# EAGLE schematic untitled (EAGLE 9.6.2)
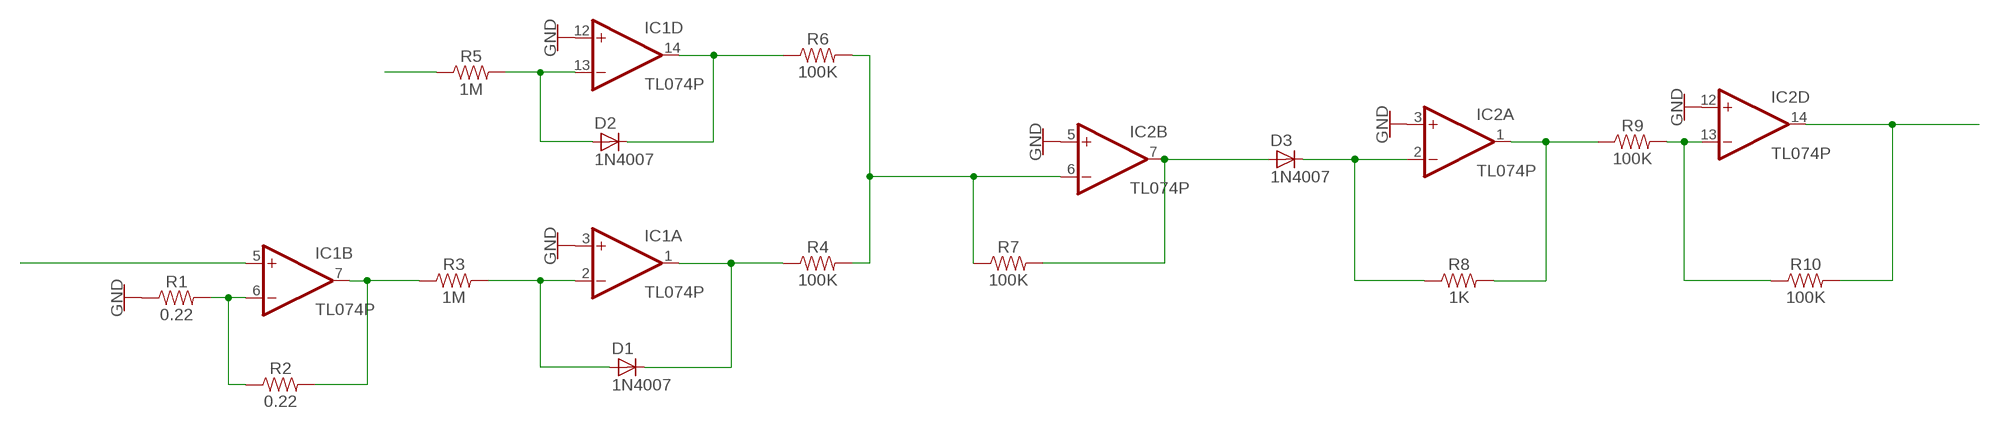
[diagram p0: schematic, sheet 1]

## Parts
D1  1N4007  [SMA]
D2  1N4007  [SMA]
D3  1N4007  [SMA]
IC1  TL074P  [DIL14]
IC2  TL074P  [DIL14]
R1  0.22  0.22OHM-0805-1/4W-1%  [0805]
R2  0.22  0.22OHM-0805-1/4W-1%  [0805]
R3  1M  0.22OHM-0805-1/4W-1%  [0805]
R4  100K  0.22OHM-0805-1/4W-1%  [0805]
R5  1M  0.22OHM-0805-1/4W-1%  [0805]
R6  100K  0.22OHM-0805-1/4W-1%  [0805]
R7  100K  0.22OHM-0805-1/4W-1%  [0805]
R8  1K  0.22OHM-0805-1/4W-1%  [0805]
R9  100K  0.22OHM-0805-1/4W-1%  [0805]
R10  100K  0.22OHM-0805-1/4W-1%  [0805]

## Nets
GND: IC1.3(A:+IN) IC1.12(D:+IN) IC2.3(A:+IN) IC2.5(B:+IN) IC2.12(D:+IN) R1.1
N$1: IC1.5(B:+IN)
N$2: IC1.6(B:-IN) R1.2 R2.1
N$3: IC1.7(B:OUT) R2.2 R3.1
N$4: D1.A IC1.2(A:-IN) R3.2
N$5: D1.K(C) IC1.1(A:OUT) R4.1
N$6: D2.K(C) IC1.14(D:OUT) R6.1
N$7: R5.1
N$8: D2.A IC1.13(D:-IN) R5.2
N$9: D3.A IC2.7(B:OUT) R7.2
N$10: D3.K(C) IC2.2(A:-IN) R8.1
N$11: IC2.6(B:-IN) R4.2 R6.2 R7.1
N$12: IC2.1(A:OUT) R8.2 R9.1
N$13: IC2.13(D:-IN) R9.2 R10.1
N$14: IC2.14(D:OUT) R10.2
Unconnected: IC1.8(C:OUT) IC1.9(C:-IN) IC1.10(C:+IN) IC2.8(C:OUT) IC2.9(C:-IN) IC2.10(C:+IN)

## Power pins joined to a net without a drawn wire
V+: IC1.4(P:V+) IC2.4(P:V+)
V-: IC1.11(P:V-) IC2.11(P:V-)

## Library data of the parts
D1-D3 = casovac:1N4007
IC1 IC2 = linear3:TL074: OP AMP
R1 R2 = SparkFun-Resistors:0.22OHM: 0.22Ω resistor A resistor is a passive two-terminal electrical component that implements electrical resistance as a circuit element. Resistors act to reduce current flow, and, at the same time, act to lower voltage levels within circuits. - Wikipedia; PROD_ID: RES-09883
R3-R10 = SparkFun-Resistors:0.22OHM: 0.22Ω resistor A resistor is a passive two-terminal electrical component that implements electrical resistance as a circuit element. Resistors act to reduce current flow, and, at the same time, act to lower voltage levels within circuits. - Wikipedia; PROD_ID: RES-09883; VALUE: 0.22